# Altium schematic sheet PS3604LD.SchDoc: PS3604LD
size A3; Author: Storozhenko Roman; CompanyName: D_EL; DrawnBy: Storozhenko Roman; Address1: Ukraine; Address2: Kharkiv; Revision: 3.1; SheetNumber: 1; SheetTotal: 1
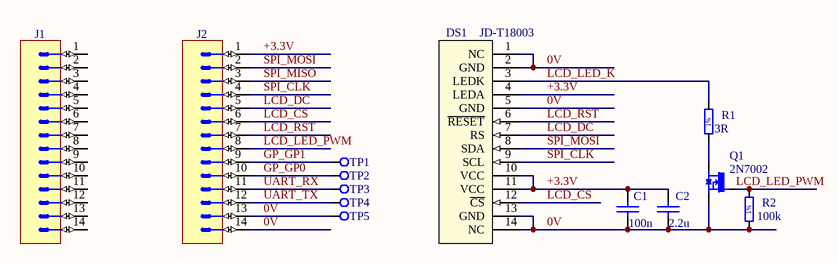
[diagram p0: PS3604LD.SchDoc]

## Parts
C1  100n  [CAPC1005X55N]
C2  2.2u  [CAPC1005X55N]
DS1  JD-T18003  [JD_T18003]
J1  Socket 14  [3M_951114-8622-AR]  (value not drawn)
J2  Socket 14  [3M_951114-8622-AR]  (value not drawn)
Q1  2N7002  [SOT95P240X130-3N]
R1  3R  [RESC2012X60N]
R2  100k  [RESC1005X40N]
TP1  Test Point  [TP_SMD_800]  (value not drawn)
TP2  Test Point  [TP_SMD_800]  (value not drawn)
TP3  Test Point  [TP_SMD_800]  (value not drawn)
TP4  Test Point  [TP_SMD_800]  (value not drawn)
TP5  Test Point  [TP_SMD_800]  (value not drawn)

## Nets
0V: C1.1 C2.1 DS1.1(NC) DS1.2(GND) DS1.5(GND) DS1.13(GND) DS1.14(NC) J2.13 J2.14 Q1.2(S) R2.1 TP5.1
+3.3V: C1.2 C2.2 DS1.4(LEDA) DS1.10(VCC) DS1.11(VCC) J2.1
GP_GP0: J2.10 TP2.1
GP_GP1: J2.9 TP1.1
LCD_CS: DS1.12(~{CS}) J2.6
LCD_DC: DS1.7(RS) J2.5
LCD_LED_K: DS1.3(LEDK) R1.2
LCD_LED_PWM: J2.8 Q1.1(G) R2.2
LCD_RST: DS1.6(~{RESET}) J2.7
SPI_CLK: DS1.9(SCL) J2.4
SPI_MISO: J2.3
SPI_MOSI: DS1.8(SDA) J2.2
UART_RX: J2.11 TP3.1
UART_TX: J2.12 TP4.1
NetQ1_3: Q1.3(D) R1.1

Not connected (* = marked no-connect by the designer): J1 1 2 3 4 5 6 7 8 9 10 11 12 13 14

## Notes on the sheet
- Title
- Size:
- Date:
- A3
- Time:
- Revision:
- Sheet
- of
- File:
- (in symbol R0402_100K_1%_0.0625W_100PPM) 1%
- (in symbol R0805_3R_1%_0.125W_200PPM) 1%

## Library data of the parts
C1 = CC0402_100NF_16V_10%_X7R: Non-polarised capacitor; Part Description: SMD Multilayer Chip Ceramic Capacitor; Manufacturer: GENERIC; Manufacturer1 Part Number: 223878715649; Voltage: 16V; TC: X7R; Tolerance: ±10%; Part Number: CC0402_100NF_16V_10%_X7R; Component Kind: Standard; Component Type: Standard; Pin Count: 2; Value: 100n; Status: Not Recommended; Manufacturer Part Number: CC0402_100NF_16V_10%_X7R; Case: 0402; Mounted: Yes; Socket: No; SMD: Yes; Manufacturer1 Example: PHYCOMP; Manufacturer1 ComponentHeight: 0.55mm; HelpURL: \\cern.ch\dfs\Applications\Altium\Datasheets\CC0402_X7R_PHYCOMP.pdf; Author: CERN DEM JLC; CreateDate: 03.12.2007; LatestRevisionDate: 03.12.2007
C2 = CC0402_2.2UF_6.3V_20%_X5R: Non-polarised capacitor; Part Description: SMD Multilayer Chip Ceramic Capacitor; Manufacturer: GENERIC; Voltage: 6.3V; TC: X5R; Tolerance: ±20%; Part Number: CC0402_2.2UF_6.3V_20%_X5R; Component Kind: Standard; Component Type: Standard; Pin Count: 2; Value: 2.2u; Status: Preferred; Manufacturer Part Number: CC0402_2.2UF_6.3V_20%_X5R; Case: 0402; Mounted: Yes; Socket: No; SMD: Yes; Manufacturer1 ComponentHeight: 0.55mm; HelpURL: \\cern.ch\dfs\Applications\Altium\Datasheets\CC0402_X5R_KEMET.pdf; Author: ELMAN; CreateDate: 19.05.2015; LatestRevisionDate: 19.05.2015
DS1 = JD_T18003: Part Description: 1.8" SPI TFT display, 160x128 18-bit color - ST7735R driver; Manufacturer: Truly Semiconductors Inc.; Manufacturer Part Number: JD-T18003-T01; Color: 16 bit / pix; Part Number: JD_T18003; Component Kind: Standard; Component Type: Standard; Device: JD-T18003; PackageDescription: 34.7 x 46.7 x 2.6 mm; Pin Count: 14; Mounted: Yes; Socket: No; SMD: Yes; ComponentHeight: 2.6mm; Author: DEL; CreateDate: 26.02.2018; LatestRevisionDate: 26.02.2018
J1 J2 = 3M_951114-8622-AR: Connector 14 Male; Part Description: 2mm Pin Strip Header, 951 Series; Manufacturer: 3M; Part Number: 3M_951114-8622-AR; Component Kind: Standard; Component Type: Standard; Pin Count: 14; Family: Socket 14; Mounted: Yes; Socket: No; SMD: No; Status: None; Manufacturer Part Number: 951114-8622-AR; ComponentHeight: 5.9mm; Author: DEL; CreateDate: 04.11.2017; LatestRevisionDate: 04.11.2017
Q1 = 2N7002: N-CHANNEL MOSFET WITH DIODE; Part Description: 60V 280mA N-Channel Enhancement Mode Field Effect Transistor (FET); Manufacturer: FAIRCHILD SEMICONDUCTOR; Part Number: 2N7002; Component Kind: Standard; Component Type: Standard; Device: 2N7002; PackageDescription: SOT23 3-Leads, Pitch 0.95mm - Body 1.3x2.9mm, IPC Medium Density; Manufacturer Part Number: 2N7002; Pin Count: 3; Case: SOT23-3; Mounted: Yes; Socket: No; SMD: Yes; ComponentHeight: 1.3mm; HelpURL: \\cern.ch\dfs\Applications\Altium\Datasheets\2N7002.pdf; Author: CERN DEM JLC; CreateDate: 20.08.2008; LatestRevisionDate: 07.04.2009
R1 = R0805_3R_1%_0.125W_200PPM: Resistor - 1%; Part Description: General Purpose Thick Film Chip Resistor; Manufacturer: GENERIC; Manufacturer1 Part Number: 232273463008; Power: 0.125W; TC: ±200ppm/°C; Part Number: R0805_3R_1%_0.125W_200PPM; Component Kind: Standard; Component Type: Standard; Pin Count: 2; Value: 3R; Status: Preferred; Tolerance: ±1%; Manufacturer Part Number: R0805_3R_1%_0.125W_200PPM; Case: 0805; Mounted: Yes; Socket: No; SMD: Yes; Manufacturer1 Example: PHYCOMP; Manufacturer1 ComponentHeight: 0.65mm; HelpURL: \\cern.ch\dfs\Applications\Altium\Datasheets\R0805_Phycomp_RC0805.pdf; Author: CERN DEM JLC; CreateDate: 03.12.2007; LatestRevisionDate: 24.06.2009
R2 = R0402_100K_1%_0.0625W_100PPM: Resistor - 1%; Part Description: General Purpose Thick Film Chip Resistor; Manufacturer: GENERIC; Manufacturer1 Part Number: 232270671004; TC: ±100ppm/°C; Part Number: R0402_100K_1%_0.0625W_100PPM; Component Kind: Standard; Component Type: Standard; Pin Count: 2; Value: 100k; Status: Not recommended; Power: 0.0625W; Tolerance: ±1%; Manufacturer Part Number: R0402_100K_1%_0.0625W_100PPM; Case: 0402; Mounted: Yes; Socket: No; SMD: Yes; Manufacturer1 Example: PHYCOMP; Manufacturer1 ComponentHeight: 0.4mm; HelpURL: \\cern.ch\dfs\Applications\Altium\Datasheets\R0402_Phycomp_RC0402.pdf; Author: CERN DEM JLC; CreateDate: 03.12.2007; LatestRevisionDate: 13.03.2008
TP1-TP5 = TP_SMD_0.8MM: Part Description: 0.8mm round SMD Pad; Mounted: No; Part Number: TP_SMD_0.8MM; Component Kind: Standard (No BOM); Component Type: Standard (No BOM); Pin Count: 1; Family: Test Point; Socket: No; SMD: No; Status: None; ComponentHeight: 0mm; Author: DEL; CreateDate: 14.11.2017; LatestRevisionDate: 14.11.2017; PackageDescription: 0.8mm round SMD Pad